# EAGLE schematic STEM (EAGLE 8.3.2)
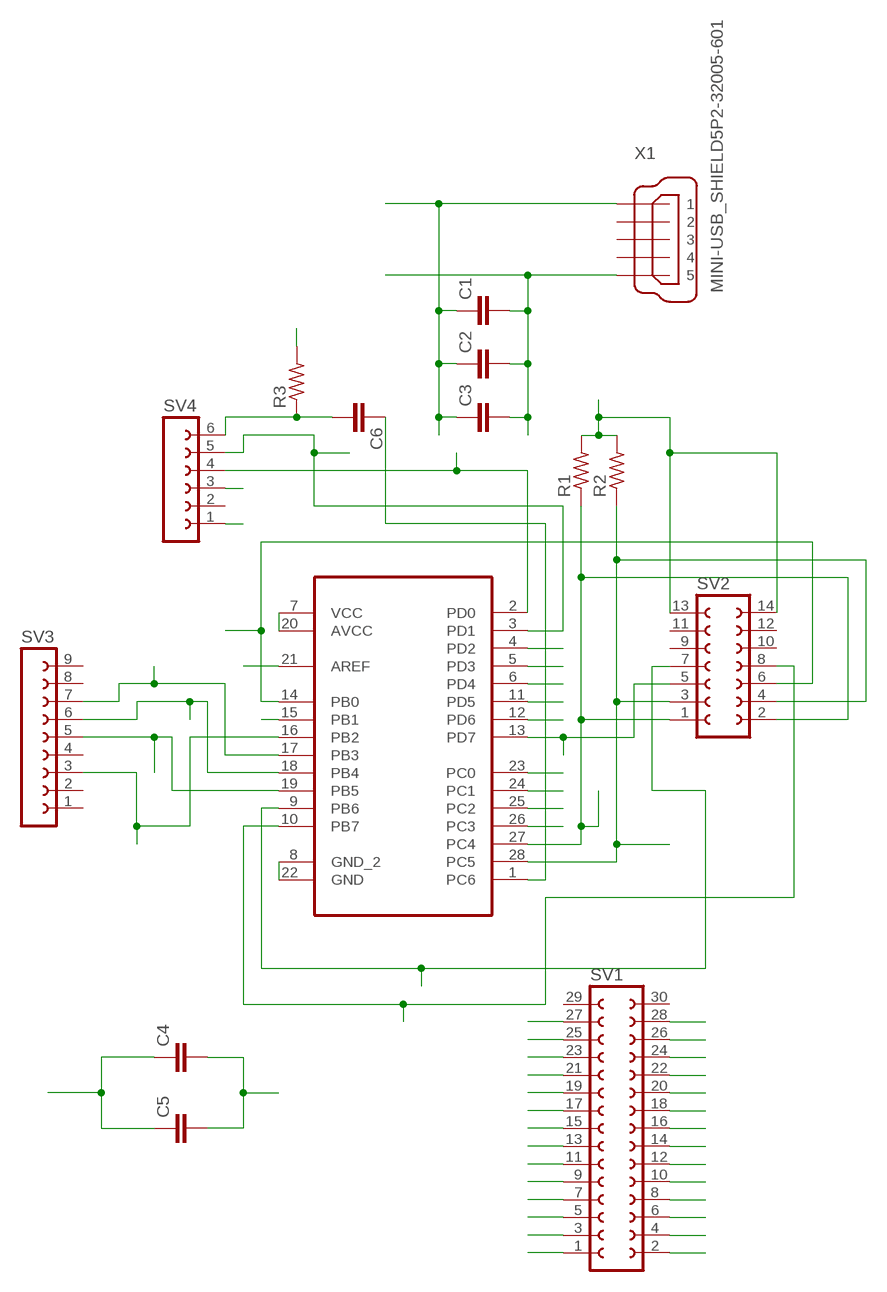
[diagram p0: schematic, sheet 1]

## Parts
C1  C2,5-3  [C2.5-3]
C2  C2,5-3  [C2.5-3]
C3  C2,5-3  [C2.5-3]
C4  C2,5-3  [C2.5-3]
C5  C2,5-3  [C2.5-3]
C6  C2,5-3  [C2.5-3]
R1  R-US_0204/7  [0204/7]
R2  R-US_0204/7  [0204/7]
R3  R-US_0204/7  [0204/7]
SV1  FE15-2  [FE15-2]
SV2  FE07-2  [FE07-2]
SV3  FE09-1  [FE09]
SV4  FE06-1  [FE06]
U1  ATMEGA328P-PU  [DIP254P762X457-28]
X1  MINI-USB_SHIELD5P2-32005-601  [32005-601]

## Nets
AREF: C4.1 C5.1 SV1.14 U1.21(AREF)
GND: C1.2 C2.2 C3.2 C4.2 C5.2 SV1.13 SV1.16 SV4.1 U1.8(GND_2) U1.22(GND) X1.5
PB0: SV1.1 SV2.6 U1.14(PB0)
PB1: SV1.2 U1.15(PB1)
PB2: SV1.4 SV3.3 U1.16(PB2)
PB3: SV1.6 SV3.7 U1.17(PB3)
PB4: SV1.8 SV3.6 U1.18(PB4)
PB5: SV1.10 SV3.5 U1.19(PB5)
PB6: SV1.11 SV2.7 U1.9(PB6)
PB7: SV1.9 SV2.8 U1.10(PB7)
PC0: SV1.18 U1.23(PC0)
PC1: SV1.20 U1.24(PC1)
PC2: SV1.22 U1.25(PC2)
PC3: SV1.24 U1.26(PC3)
PC4: R1.1 SV1.26 SV2.1 SV2.2 U1.27(PC4)
PC5: R2.1 SV1.28 SV2.3 SV2.4 U1.28(PC5)
PC6: C6.1 SV1.27 U1.1(PC6)
PC62: C6.2 R3.1 SV4.6
PD0: SV1.25 SV4.4 U1.2(PD0)
PD1: SV1.23 SV4.5 U1.3(PD1)
PD2: SV1.21 U1.4(PD2)
PD3: SV1.19 U1.5(PD3)
PD4: SV1.17 U1.6(PD4)
PD5: SV1.7 U1.11(PD5)
PD6: SV1.5 U1.12(PD6)
PD7: SV1.3 SV2.5 U1.13(PD7)
VCC: C1.1 C2.1 C3.1 R1.2 R2.2 R3.2 SV1.12 SV1.15 SV2.13 SV2.14 SV4.3 U1.7(VCC) U1.20(AVCC) X1.1
Unconnected: SV1.29 SV1.30 SV2.9 SV2.10 SV2.11 SV2.12 SV3.1 SV3.2 SV3.4 SV3.8 SV3.9 SV4.2 X1.2 X1.3 X1.4 X1.M1(S1) X1.M2(S2)

## Library data of the parts
C1-C6 = capacitor-wima:C: CAPACITOR naming: grid - package width
R1-R3 = rcl:R-US_: RESISTOR, American symbol
SV1 = con-lsta:FE15-2: FEMALE HEADER; OC_FARNELL: unknown; OC_NEWARK: unknown
SV2 = con-lsta:FE07-2: FEMALE HEADER; OC_FARNELL: unknown; OC_NEWARK: unknown
SV3 = con-lsta:FE09-1: FEMALE HEADER; OC_FARNELL: unknown; OC_NEWARK: unknown
SV4 = con-lsta:FE06-1: FEMALE HEADER; OC_FARNELL: unknown; OC_NEWARK: unknown
U1 = Atmel_By_element14_Batch_1-00:ATMEGA328P-PU: 8-bit Microcontroller with In-System Programmable Flash; MPN: ATMEGA328P-PU; OC_FARNELL: 1715487; OC_NEWARK: 15R0268; PACKAGE: PDIP-28; SUPPLIER: Atmel
X1 = con-cypressindustries:MINI-USB_SHIELD5P2-: MINI USB-B R/A DIP 5pol. Source: www.cypressindustries.com; OC_FARNELL: unknown; OC_NEWARK: unknown